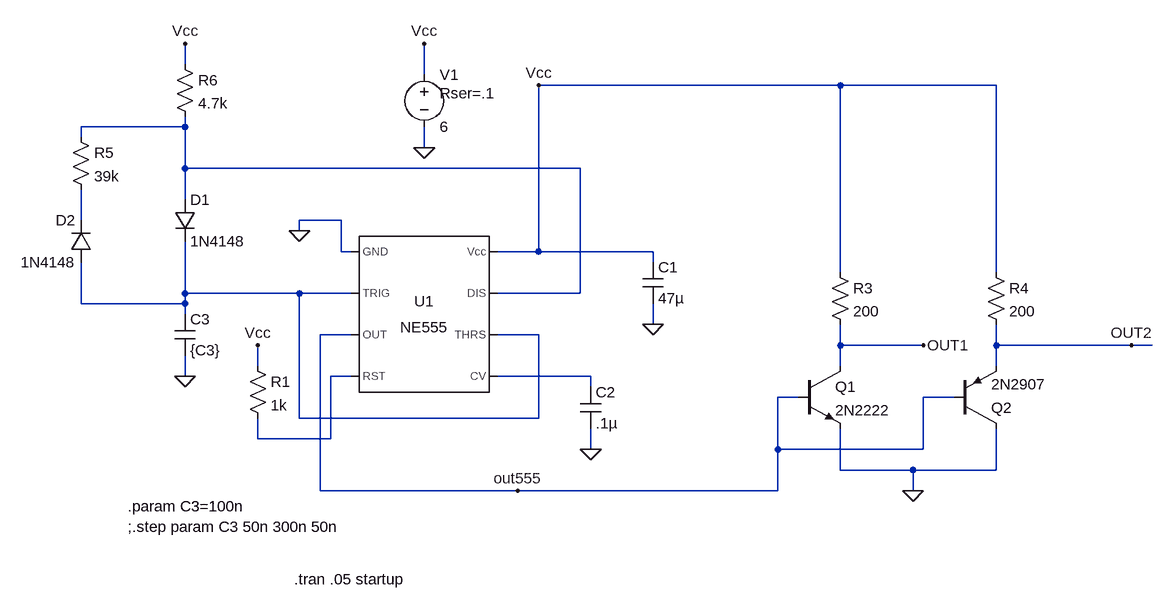
[diagram p0: schematic NE555_Duty.asc]
NE555_Duty.asc, the LTspice schematic file:
Version 4
SHEET 1 1640 740
WIRE -96 -176 -96 -208
WIRE 272 -160 272 -208
WIRE 912 -144 448 -144
WIRE 1152 -144 912 -144
WIRE -96 -80 -96 -96
WIRE -96 -80 -256 -80
WIRE -256 -64 -256 -80
WIRE 272 -48 272 -80
WIRE -96 -16 -96 -80
WIRE 512 -16 -96 -16
WIRE -96 32 -96 -16
WIRE -256 64 -256 16
WIRE 144 64 80 64
WIRE 80 80 80 64
WIRE 144 112 144 64
WIRE 160 112 144 112
WIRE 448 112 448 -144
WIRE 448 112 384 112
WIRE 624 112 448 112
WIRE 624 128 624 112
WIRE 912 144 912 -144
WIRE 1152 144 1152 -144
WIRE -96 176 -96 96
WIRE 80 176 -96 176
WIRE 160 176 80 176
WIRE 512 176 512 -16
WIRE 512 176 384 176
WIRE -256 192 -256 128
WIRE -96 192 -96 176
WIRE -96 192 -256 192
WIRE -96 208 -96 192
WIRE 624 224 624 192
WIRE 160 240 112 240
WIRE 448 240 384 240
WIRE 912 256 912 224
WIRE 1040 256 912 256
WIRE 1152 256 1152 224
WIRE 1360 256 1152 256
WIRE 1392 256 1360 256
WIRE 16 288 16 256
WIRE 912 288 912 256
WIRE 1152 288 1152 256
WIRE -96 304 -96 272
WIRE 160 304 128 304
WIRE 528 304 384 304
WIRE 528 320 528 304
WIRE 848 336 816 336
WIRE 1088 336 1040 336
WIRE 80 368 80 176
WIRE 448 368 448 240
WIRE 448 368 80 368
WIRE 16 400 16 368
WIRE 128 400 128 304
WIRE 128 400 16 400
WIRE 528 416 528 384
WIRE 816 416 816 336
WIRE 1040 416 1040 336
WIRE 1040 416 816 416
WIRE 912 448 912 384
WIRE 1024 448 912 448
WIRE 1152 448 1152 384
WIRE 1152 448 1024 448
WIRE 112 480 112 240
WIRE 416 480 112 480
WIRE 816 480 816 416
WIRE 816 480 416 480
WIRE 1024 480 1024 448
FLAG 272 -48 0
FLAG 528 416 0
FLAG 80 80 0
FLAG 1360 256 OUT2
FLAG 1024 480 0
FLAG 1040 256 OUT1
FLAG -96 304 0
FLAG -96 -208 Vcc
FLAG 272 -208 Vcc
FLAG 448 -144 Vcc
FLAG 624 224 0
FLAG 16 256 Vcc
FLAG 416 480 out555
SYMBOL NE555 272 208 R0
SYMATTR InstName U1
SYMBOL voltage 272 -176 R0
WINDOW 123 0 0 Left 0
WINDOW 39 24 44 Left 2
SYMATTR SpiceLine Rser=.1
SYMATTR InstName V1
SYMATTR Value 6
SYMBOL cap 512 320 R0
SYMATTR InstName C2
SYMATTR Value .1µ
SYMBOL npn 848 288 R0
SYMATTR InstName Q1
SYMATTR Value 2N2222
SYMBOL pnp 1088 384 M180
SYMATTR InstName Q2
SYMATTR Value 2N2907
SYMBOL res 896 128 R0
SYMATTR InstName R3
SYMATTR Value 200
SYMBOL res 1136 128 R0
SYMATTR InstName R4
SYMATTR Value 200
SYMBOL diode -112 32 R0
SYMATTR InstName D1
SYMATTR Value 1N4148
SYMBOL diode -240 128 R180
WINDOW 0 24 64 Left 2
WINDOW 3 24 0 Left 2
SYMATTR InstName D2
SYMATTR Value 1N4148
SYMBOL res -272 -80 R0
SYMATTR InstName R5
SYMATTR Value 39k
SYMBOL res -112 -192 R0
SYMATTR InstName R6
SYMATTR Value 4.7k
SYMBOL cap -112 208 R0
SYMATTR InstName C3
SYMATTR Value {C3}
SYMBOL cap 608 128 R0
SYMATTR InstName C1
SYMATTR Value 47µ
SYMBOL res 0 272 R0
SYMATTR InstName R1
SYMATTR Value 1k
TEXT 72 616 Left 2 !.tran .05 startup
TEXT -184 504 Left 2 !.param C3=100n\n;.step param C3 50n 300n 50n

The netlist it stands for:
* NE555_Duty.asc
XU1 0 N003 out555 N004 N005 N003 N001 Vcc NE555  ; pins GND TRIG OUT RST CV THRS DIS Vcc
V1 Vcc 0 6 Rser=.1
C2 N005 0 .1µ
Q1 OUT1 out555 0 0 2N2222
Q2 0 out555 OUT2 0 2N2907
R3 Vcc OUT1 200
R4 Vcc OUT2 200
D1 N001 N003 1N4148
D2 N003 N002 1N4148
R5 N001 N002 39k
R6 Vcc N001 4.7k
C3 N003 0 {C3}
C1 Vcc 0 47µ
R1 Vcc N004 1k
.model D D
.lib standard.dio
.model NPN NPN
.model PNP PNP
.lib standard.bjt
.tran .05 startup
.param C3=100n
;.step param C3 50n 300n 50n
.lib NE555.sub
.backanno
.end